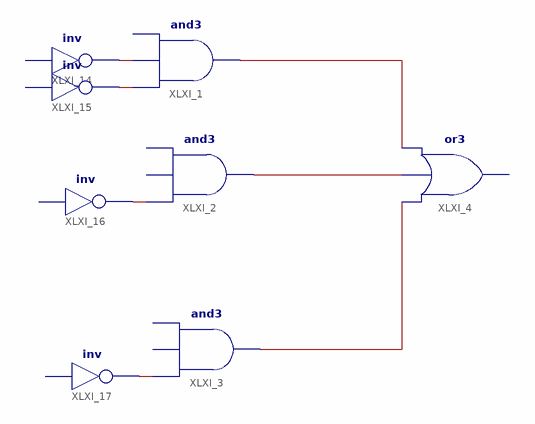
[diagram p0: schematic sheet 1]
// Xilinx ISE schematic circuit.sch (spartan3e) as structural Verilog: 8 symbols, 0 ports
module circuit (
);

  wire XLXN_1, XLXN_2, XLXN_3, XLXN_4, XLXN_5, XLXN_6, XLXN_7;

  // or3 XLXI_4 has open pins: I0=XLXN_3, I1=XLXN_2, I2=XLXN_1, O=open
  and XLXI_1 (XLXN_1, XLXN_5, XLXN_4);  // open: I2
  buf XLXI_2 (XLXN_2, XLXN_6);  // and3 open: I1, I2
  buf XLXI_3 (XLXN_3, XLXN_7);  // and3 open: I1, I2
  // inv XLXI_14 has open pins: I=open, O=XLXN_4
  // inv XLXI_15 has open pins: I=open, O=XLXN_5
  // inv XLXI_16 has open pins: I=open, O=XLXN_6
  // inv XLXI_17 has open pins: I=open, O=XLXN_7
endmodule
